# Altium schematic sheet TELM0003_TempSense_BCR.SchDoc: Temperature Sensor Circuit
size A3; Engineer: A. SHAW; Organization: BLUEsat Project; Address1: Room 419; Address2: School of EE&T; Address3: UNSW, NSW 2052; Address4: Australia; DocumentNumber: TELM0003; SheetNumber: 1; SheetTotal: 1; Version: 1.0
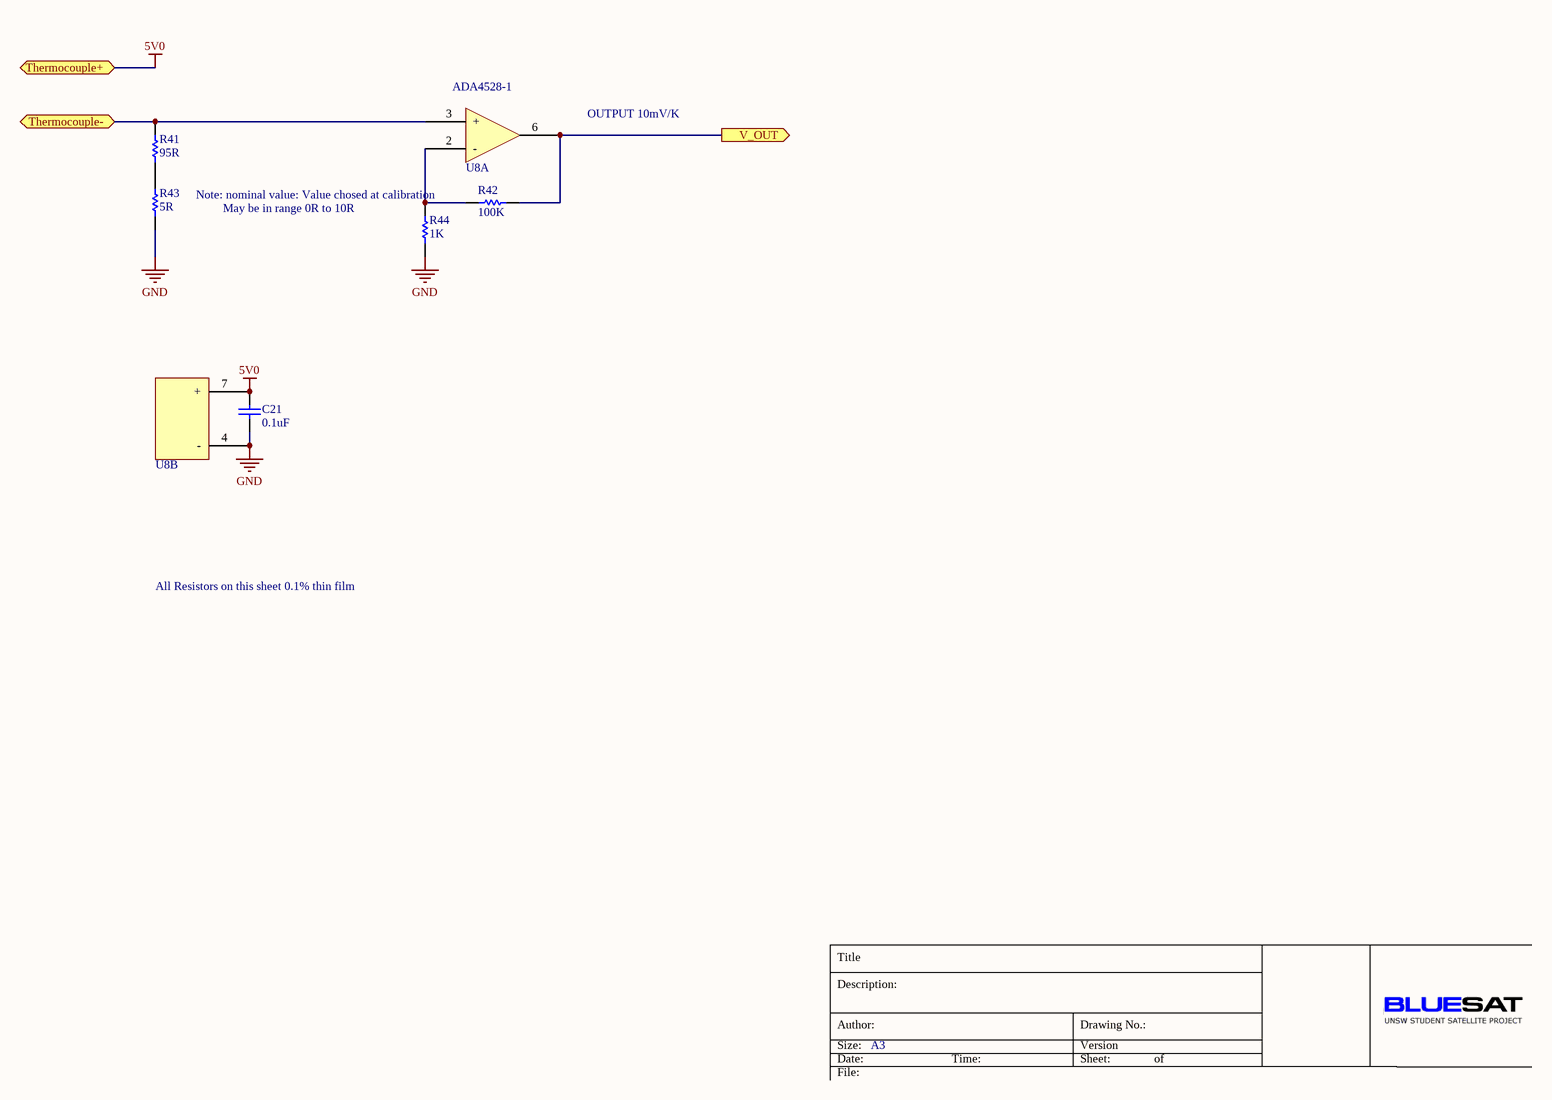
[diagram p0: TELM0003_TempSense_BCR.SchDoc]

## Parts
C21  value 0.1uF  [CAPC2012M]  (hidden comment: Cap)
R41  value 95R  [RESC2012M]  (hidden comment: 0805 Resistor)
R42  value 100K  [RESC2012M]  (hidden comment: 0805 Resistor)
R43  value 5R  [RESC2012M]  (hidden comment: 0805 Resistor)
R44  value 1K  [RESC2012M]  (hidden comment: 0805 Resistor)
U8  ADA4528-1  [SOIC8 - LME49720]  (parts A,B of 2)

## Ports
Thermocouple+, Thermocouple-, V_OUT (out)

## Nets
5V0: C21.1 U8.7(+) ; port Thermocouple+
GND: C21.2 R43.2 R44.2 U8.4(-)
Thermocouple-: R41.1 U8.3(+) ; port Thermocouple-
V_OUT: R42.2 U8.6(Out) ; port V_OUT
NetR41_2: R41.2 R43.1
NetR42_1: R42.1 R44.1 U8.2(-)

## Notes on the sheet
- OUTPUT 10mV/K
- (near R42) Note: nominal value: Value chosed at calibration
- May be in range 0R to 10R
- All Resistors on this sheet 0.1% thin film
- Title
- Description:
- Size:
- Author:
- Date:
- A3
- Time:
- Version
- Sheet:
- Drawing No.:
- of
- File:

## Library data of the parts
C21 = Cap: Capacitor; Published: 8-Jun-2000; LatestRevisionDate: 17-Jul-2002; LatestRevisionNote: Re-released for DXP Platform.; PackageReference: RAD-0.3; Publisher: Altium Limited; PackageDescription: Radial Cap, Thru-Hole; 2 Leads; 0.3 in Pin Spacing; Supplier 1: Farnell; Supplier 2: Farnell; Supplier Part Number 2: 1759265
R41-R44 = Res1: Resistor; Published: 8-Jun-2000; LatestRevisionDate: 17-Jul-2002; LatestRevisionNote: Re-released for DXP Platform.; PackageReference: AXIAL-0.3; Publisher: Altium Limited; PackageDescription: Axial Device, Thru-Hole; 2 Leads; 0.3 in Pin Spacing; Supplier 1: Farnell
U8 = ADA4528-1: Dual, High Performance Audio Operational Amplifier; ComponentLink1Description: Datasheet; ComponentLink1URL: http://www.national.com/ds/LM/LME49720.pdf